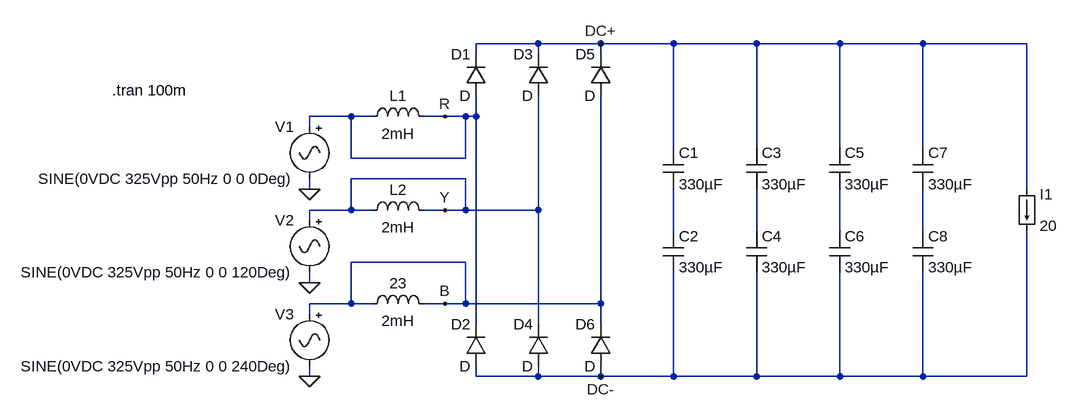
[diagram p0: schematic 3ph AC rectifier (325VAC).asc]
3ph AC rectifier (325VAC).asc, the LTspice schematic file:
Version 4
SHEET 1 1008 680
WIRE 192 -96 96 -96
WIRE 288 -96 192 -96
WIRE 400 -96 288 -96
WIRE 528 -96 400 -96
WIRE 656 -96 528 -96
WIRE 784 -96 656 -96
WIRE 944 -96 784 -96
WIRE 96 -80 96 -96
WIRE 192 -80 192 -96
WIRE 288 -80 288 -96
WIRE -128 16 -160 16
WIRE -96 16 -128 16
WIRE -64 16 -96 16
WIRE 48 16 16 16
WIRE 80 16 48 16
WIRE 96 16 96 -16
WIRE 96 16 80 16
WIRE -160 32 -160 16
WIRE 400 64 400 -96
WIRE 528 64 528 -96
WIRE 656 64 656 -96
WIRE 784 64 784 -96
WIRE -96 80 -96 16
WIRE 80 80 80 16
WIRE 80 80 -96 80
WIRE 80 112 -96 112
WIRE -160 128 -160 112
WIRE 944 128 944 -96
WIRE -112 160 -160 160
WIRE -96 160 -96 112
WIRE -96 160 -112 160
WIRE -64 160 -96 160
WIRE 48 160 16 160
WIRE 80 160 80 112
WIRE 80 160 48 160
WIRE 192 160 192 -16
WIRE 192 160 80 160
WIRE -160 176 -160 160
WIRE 400 192 400 128
WIRE 528 192 528 128
WIRE 656 192 656 128
WIRE 784 192 784 128
WIRE 80 240 -96 240
WIRE -160 272 -160 256
WIRE -112 304 -160 304
WIRE -96 304 -96 240
WIRE -96 304 -112 304
WIRE -64 304 -96 304
WIRE 48 304 16 304
WIRE 80 304 80 240
WIRE 80 304 48 304
WIRE 288 304 288 -16
WIRE 288 304 80 304
WIRE -160 320 -160 304
WIRE 96 336 96 16
WIRE 192 336 192 160
WIRE 288 336 288 304
WIRE -160 416 -160 400
WIRE 96 416 96 400
WIRE 192 416 192 400
WIRE 192 416 96 416
WIRE 288 416 288 400
WIRE 288 416 192 416
WIRE 400 416 400 256
WIRE 400 416 288 416
WIRE 528 416 528 256
WIRE 528 416 400 416
WIRE 656 416 656 256
WIRE 656 416 528 416
WIRE 784 416 784 256
WIRE 784 416 656 416
WIRE 944 416 944 192
WIRE 944 416 784 416
FLAG -160 128 0
FLAG -160 272 0
FLAG -160 416 0
FLAG 48 16 R
FLAG 48 160 Y
FLAG 48 304 B
FLAG 288 -96 DC+
FLAG 288 416 DC-
DATAFLAG -128 16 "$-V(Y)"
DATAFLAG -112 160 "$-V(B)"
DATAFLAG -112 304 "$-V(R)"
SYMBOL Misc\\signal -160 16 M0
WINDOW 123 0 0 Left 2
WINDOW 39 0 0 Left 2
SYMATTR InstName V1
SYMATTR Value SINE(0VDC 325Vpp 50Hz 0 0 0Deg)
SYMBOL Misc\\signal -160 160 M0
WINDOW 123 0 0 Left 2
WINDOW 39 0 0 Left 2
SYMATTR InstName V2
SYMATTR Value SINE(0VDC 325Vpp 50Hz 0 0 120Deg)
SYMBOL Misc\\signal -160 304 M0
WINDOW 123 0 0 Left 2
WINDOW 39 0 0 Left 2
SYMATTR InstName V3
SYMATTR Value SINE(0VDC 325Vpp 50Hz 0 0 240Deg)
SYMBOL diode 112 -16 R180
WINDOW 0 24 64 Left 2
WINDOW 3 24 0 Left 2
SYMATTR InstName D1
SYMBOL diode 112 400 R180
WINDOW 0 24 64 Left 2
WINDOW 3 24 0 Left 2
SYMATTR InstName D2
SYMBOL diode 208 -16 R180
WINDOW 0 24 64 Left 2
WINDOW 3 24 0 Left 2
SYMATTR InstName D3
SYMBOL diode 208 400 R180
WINDOW 0 24 64 Left 2
WINDOW 3 24 0 Left 2
SYMATTR InstName D4
SYMBOL diode 304 -16 R180
WINDOW 0 24 64 Left 2
WINDOW 3 24 0 Left 2
SYMATTR InstName D5
SYMBOL diode 304 400 R180
WINDOW 0 24 64 Left 2
WINDOW 3 24 0 Left 2
SYMATTR InstName D6
SYMBOL cap 384 64 R0
SYMATTR InstName C1
SYMATTR Value 330µF
SYMATTR SpiceLine V=400 Irms=2 Rser=1.2 Lser=10uH
SYMBOL cap 384 192 R0
SYMATTR InstName C2
SYMATTR Value 330µF
SYMATTR SpiceLine V=400 Irms=2 Rser=1.2 Lser=10uH
SYMBOL cap 512 64 R0
SYMATTR InstName C3
SYMATTR Value 330µF
SYMATTR SpiceLine V=400 Irms=2 Rser=1.2 Lser=10uH
SYMBOL cap 512 192 R0
SYMATTR InstName C4
SYMATTR Value 330µF
SYMATTR SpiceLine V=400 Irms=2 Rser=1.2 Lser=10uH
SYMBOL cap 640 64 R0
SYMATTR InstName C5
SYMATTR Value 330µF
SYMATTR SpiceLine V=400 Irms=2 Rser=1.2 Lser=10uH
SYMBOL cap 640 192 R0
SYMATTR InstName C6
SYMATTR Value 330µF
SYMATTR SpiceLine V=400 Irms=2 Rser=1.2 Lser=10uH
SYMBOL cap 768 64 R0
SYMATTR InstName C7
SYMATTR Value 330µF
SYMATTR SpiceLine V=400 Irms=2 Rser=1.2 Lser=10uH
SYMBOL cap 768 192 R0
SYMATTR InstName C8
SYMATTR Value 330µF
SYMATTR SpiceLine V=400 Irms=2 Rser=1.2 Lser=10uH
SYMBOL load 928 128 R0
WINDOW 123 0 0 Left 2
WINDOW 39 0 0 Left 2
SYMATTR InstName I1
SYMATTR Value 20
SYMBOL ind -80 32 R270
WINDOW 0 32 56 VTop 2
WINDOW 3 5 56 VBottom 2
SYMATTR InstName L1
SYMATTR Value 2mH
SYMBOL ind -80 176 R270
WINDOW 0 32 56 VTop 2
WINDOW 3 5 56 VBottom 2
SYMATTR InstName L2
SYMATTR Value 2mH
SYMBOL ind -80 320 R270
WINDOW 0 32 56 VTop 2
WINDOW 3 5 56 VBottom 2
SYMATTR InstName 23
SYMATTR Value 2mH
TEXT -464 -24 Left 2 !.tran 100m

The netlist it stands for:
* 3ph AC rectifier (325VAC).asc
V1 R 0 SINE(0VDC 325Vpp 50Hz 0 0 0Deg)
V2 Y 0 SINE(0VDC 325Vpp 50Hz 0 0 120Deg)
V3 B 0 SINE(0VDC 325Vpp 50Hz 0 0 240Deg)
D1 R DC+ D
D2 DC- R D
D3 Y DC+ D
D4 DC- Y D
D5 B DC+ D
D6 DC- B D
C1 DC+ N001 330µF V=400 Irms=2 Rser=1.2 Lser=10uH
C2 N001 DC- 330µF V=400 Irms=2 Rser=1.2 Lser=10uH
C3 DC+ N002 330µF V=400 Irms=2 Rser=1.2 Lser=10uH
C4 N002 DC- 330µF V=400 Irms=2 Rser=1.2 Lser=10uH
C5 DC+ N003 330µF V=400 Irms=2 Rser=1.2 Lser=10uH
C6 N003 DC- 330µF V=400 Irms=2 Rser=1.2 Lser=10uH
C7 DC+ N004 330µF V=400 Irms=2 Rser=1.2 Lser=10uH
C8 N004 DC- 330µF V=400 Irms=2 Rser=1.2 Lser=10uH
I1 DC+ DC- 20
L1 R R 2mH
L2 Y Y 2mH
L§23 B B 2mH
.model D D
.lib standard.dio
.tran 100m
.backanno
.end